# EAGLE design 3pdt (EAGLE 6.6.0)
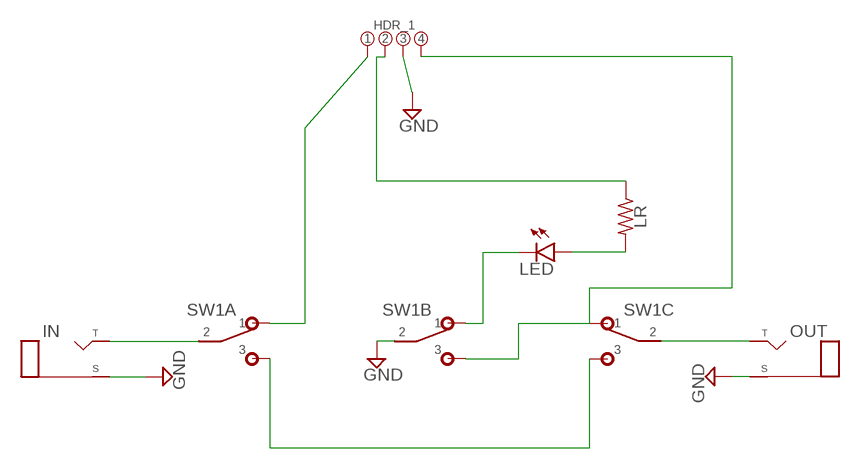
[diagram p0: schematic, sheet 1]

## Parts
HDR_1  4PIN  [4PIN]
IN  MONO  [TWO_PADS]
LED  LED  [3MM_D]
LR  R_.1  [R0207/1V]
OUT  MONO  [TWO_PADS]
SW1  3PDT  [3PDT]

## Nets
GND: HDR_1.P$3 IN.S(SLEEVE) OUT.S(SLEEVE) SW1.B2
N$1: LED.ANODE(A) LR.2
N$2: SW1.A3 SW1.C3
N$3: OUT.T(TIP) SW1.C2
N$4: IN.T(TIP) SW1.A2
N$5: HDR_1.P$4 SW1.B3 SW1.C1
N$6: LED.P$1(C) SW1.B1
N$7: HDR_1.P$2 LR.1
N$8: HDR_1.P$1 SW1.A1

## Library data of the parts
HDR_1 = headers:4PIN
IN OUT = jacks:MONO: Mono 1/4" Phone Jack
LED = diodes:LED
LR = resistors:R_
SW1 = switches:3PDT

## Board
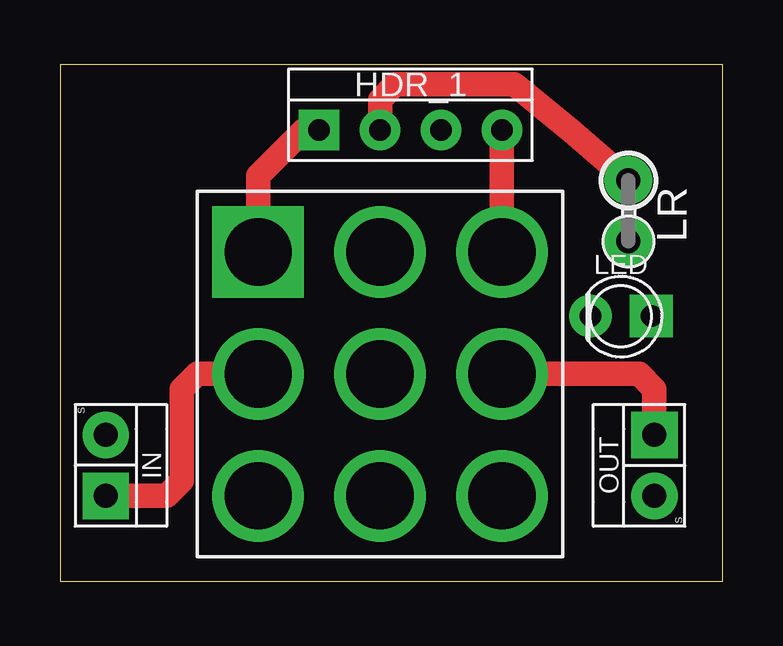
[diagram p1: board, top side]
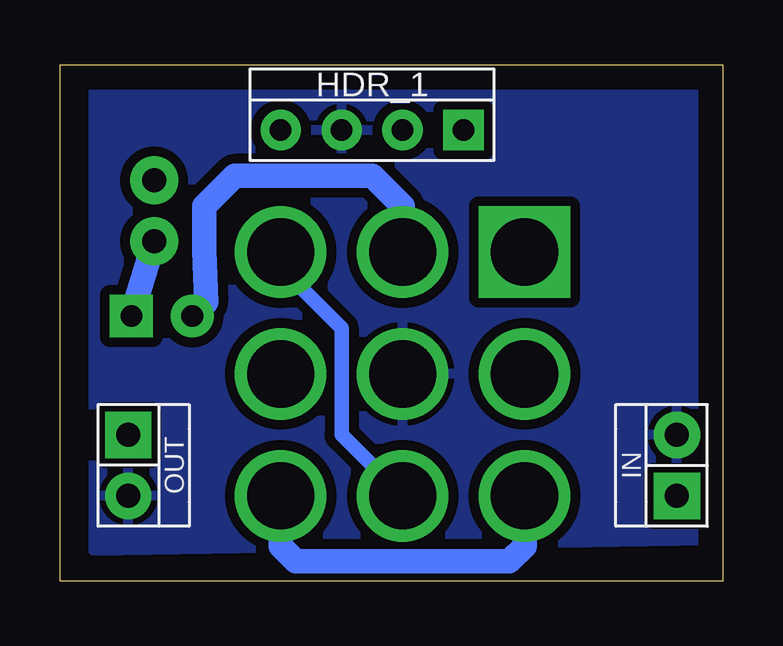
[diagram p2: board, bottom side, seen from below]

Size 27.61 x 21.52 mm. Coordinates in mm from the lower left corner, seen from the top.
Outline: 0,0 27.61,0 27.61,21.52 0,21.52 0,0
Copper layers (1*16): Top 0.035mm / dielectric 1.5mm / Bottom 0.035mm
Design rules "default": minimum track width 10mil, minimum drill 24mil, track to track 8mil, track to pad 8mil, pad to pad 8mil, via to via 8mil, smd to smd 8mil, copper to edge 40mil, drill to drill 8mil, minimum pad ring 10mil, minimum via ring 8mil, stop-mask expansion 4mil, vias tented up to drill 0mil, thermal gap 10mil

### Footprints (pad centres in the part's own frame; a part is rotated, then mirrored left to right if it is on the bottom)
4PIN = drill 0.9 pad 1.676 square: P$1 -3.81,0 | drill 0.9 pad 1.676: P$2 -1.27,0; P$3 1.27,0; P$4 3.81,0
TWO_PADS = drill 1 pad 1.93: S -1.27,0 | drill 1 pad 1.93 square: T 1.27,0
3MM_D = drill 0.9 pad 1.778 square: ANODE -1.27,0 | drill 0.9 pad 1.778: P$1 1.27,0
R0207/1V = drill 1 pad 2: 1 -1.27,0; 2 1.27,0
3PDT = drill 2.8 square: A1 -5.08,5.08 | drill 2.8: A2 -5.08,0; A3 -5.08,-5.08; B1 0,5.08; B2 0,0; B3 0,-5.08; C1 5.08,5.08; C2 5.08,0; C3 5.08,-5.08

### Placement (x,y rotation side)
HDR_1  14.6,18.8 0 top
IN  1.9,4.83 270 top
LED  23.37,11.05 180 top
LR  23.69,15.43 270 top
OUT  24.77,4.83 90 top
SW1  13.33,8.64 0 top

### Tracks (layer width: path | path; a pad name or v marks a point on that pad's centre or on a via)
GND
  pour Bottom (isolate 0.406): 0.63,21.34 26.23,20.89 26.23,1.27 0.63,1.71
N$1
  Bottom 1.016: LED.ANODE LR.2
N$2
  Bottom 1.016: SW1.A3 8.26,1.46 8.89,0.83 17.78,0.83 18.41,1.46 SW1.C3
N$3
  Top 1.016: SW1.C2 24.13,8.64 24.77,8 OUT.T
N$4
  Top 1.016: IN.T 4.45,3.56 5.08,4.19 5.08,8 5.71,8.64 SW1.A2
N$5
  Top 1.016: SW1.C1 HDR_1.P$4
  Bottom 0.61: SW1.C1 18.41,13.08 15.87,10.54 15.87,6.1 SW1.B3
N$6
  Bottom 1.016: SW1.B1 13.33,15.62 14.6,16.89 20.32,16.89 21.59,15.62 21.59,13.78 21.53,11.62 LED.P$1
N$7
  Top 1.016: LR.1 21.34,18.73 18.92,20.7 13.97,20.7 13.33,20.07 HDR_1.P$2
N$8
  Top 1.016: HDR_1.P$1 10.16,18.8 8.26,16.89 SW1.A1